# Altium schematic sheet BCM3.SchDoc
size A4; SheetNumber: 3; SheetTotal: 5
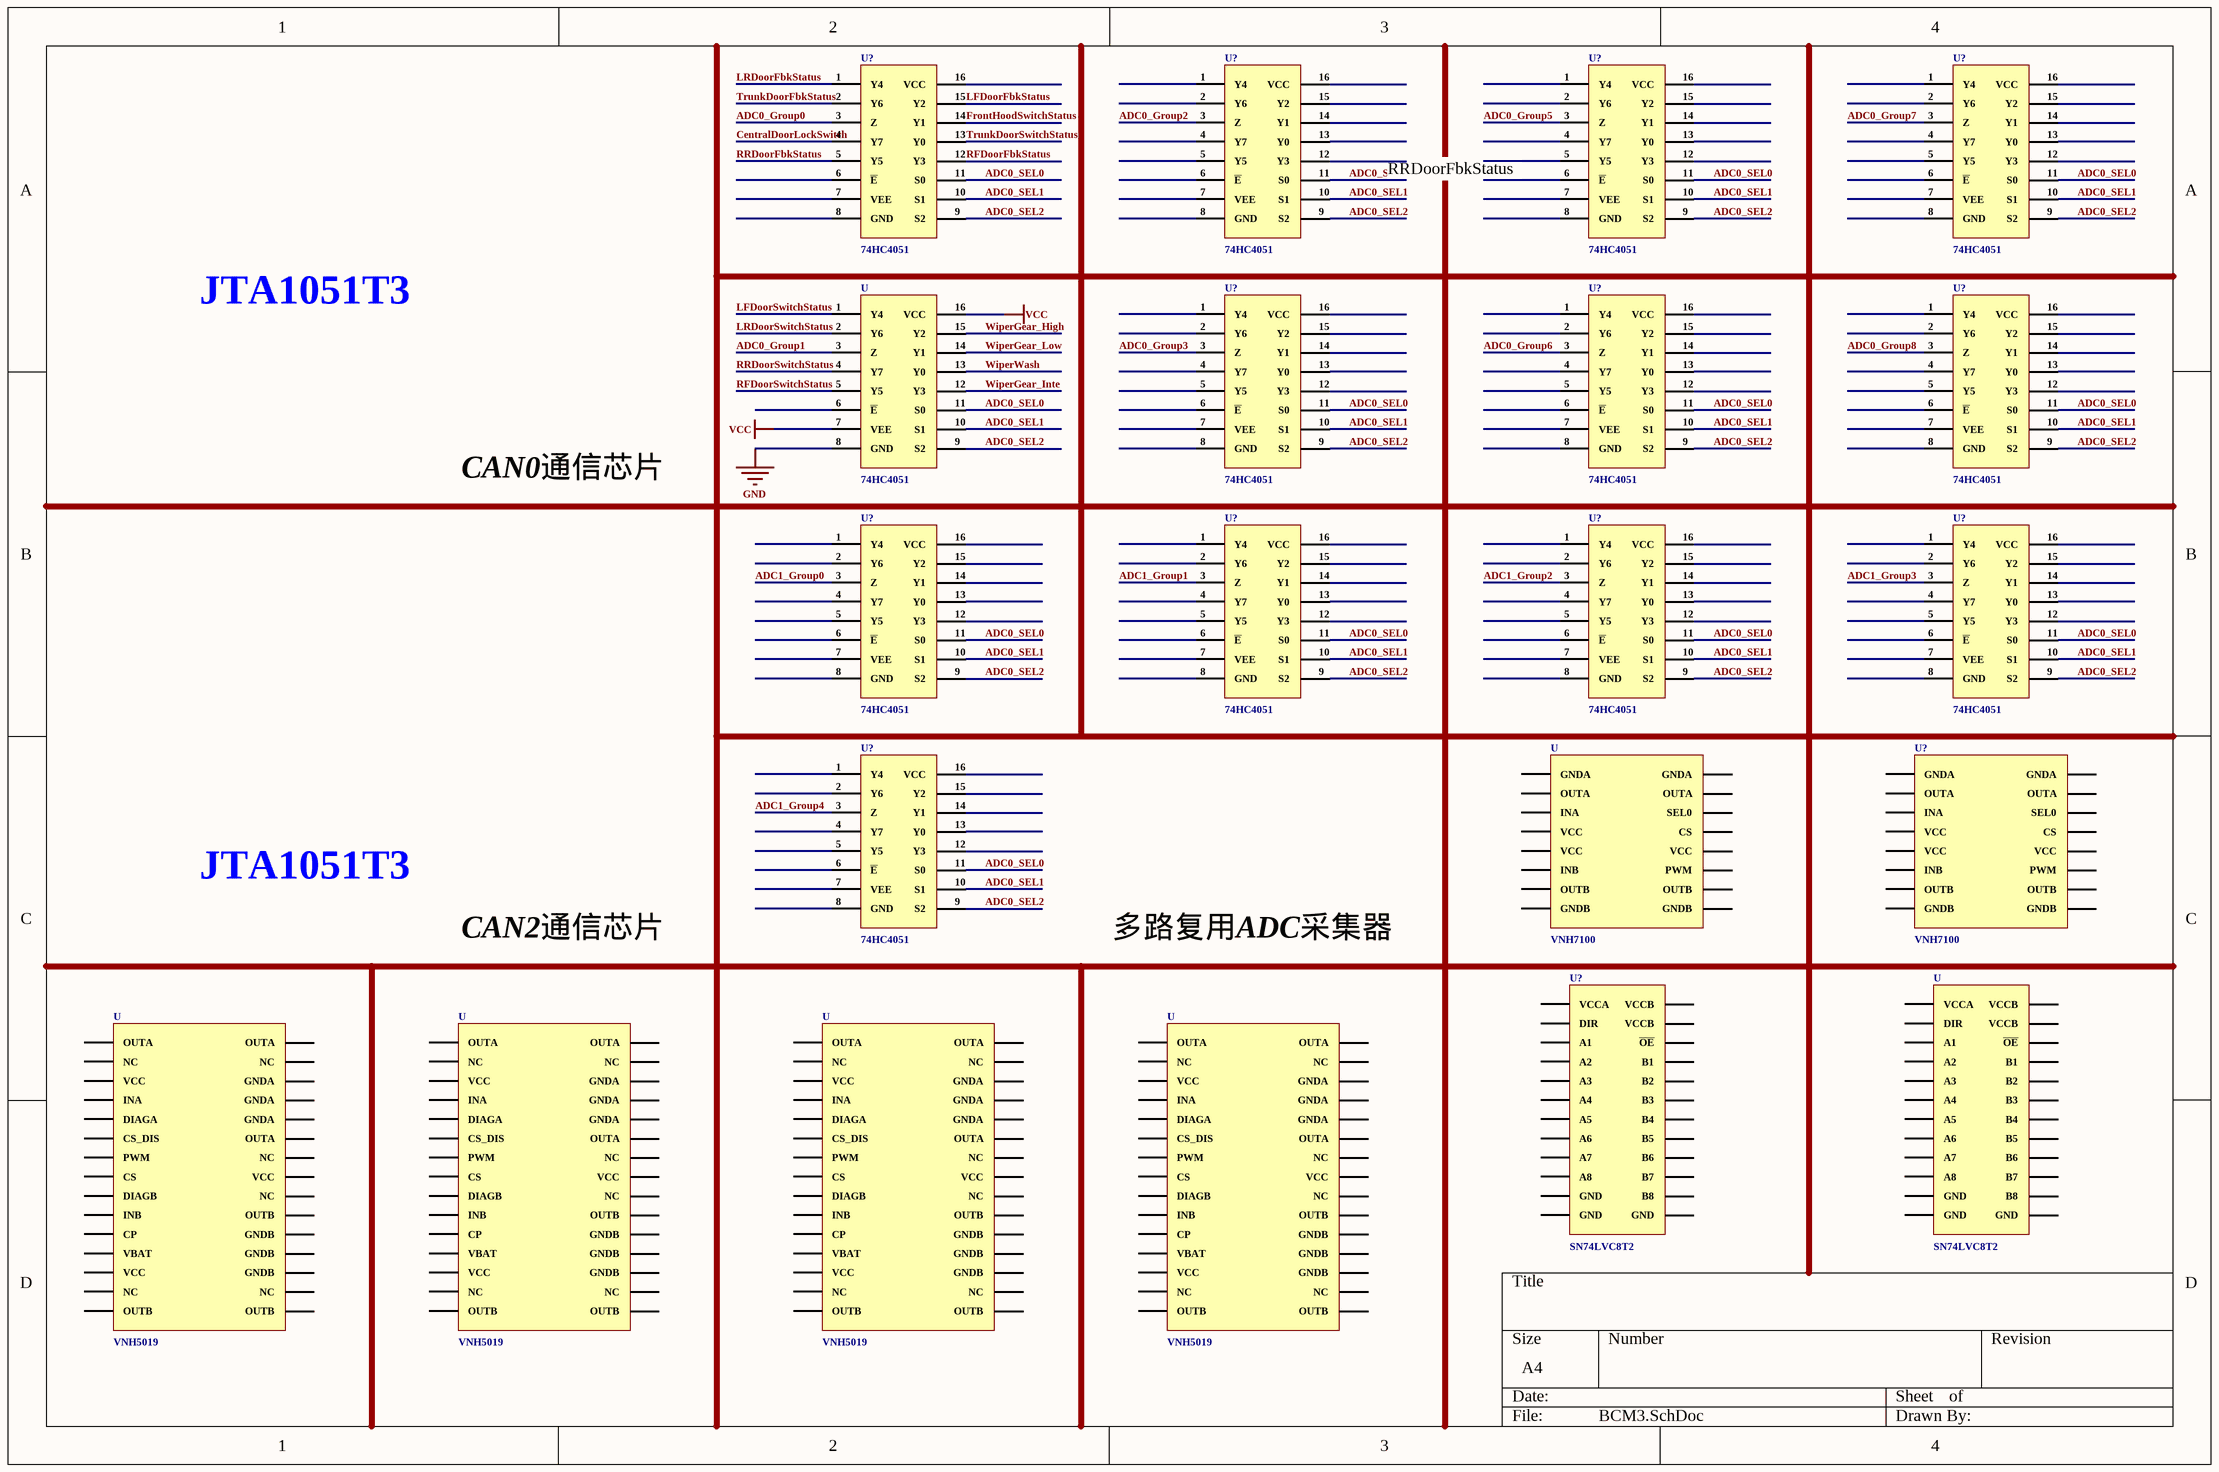
[diagram p0: BCM3.SchDoc]

## Parts
(Parts that share a designator on the sheet are numbered #1, #2 ... from top to bottom, then left to right.)
U#1  74HC4051
U#2  VNH7100
U#3  SN74LVC8T2
U#4  VNH5019
U#5  VNH5019
U#6  VNH5019
U#7  VNH5019
U?#1  74HC4051
U?#2  74HC4051
U?#3  74HC4051
U?#4  74HC4051
U?#5  74HC4051
U?#6  74HC4051
U?#7  74HC4051
U?#8  74HC4051
U?#9  74HC4051
U?#10  74HC4051
U?#11  74HC4051
U?#12  74HC4051
U?#13  VNH7100
U?#14  SN74LVC8T2

## Nets
GND: U#1.8(GND)
VCC: U#1.7(VEE) U#1.16(VCC)
ADC0_Group0: U?#1.3(Z)
ADC0_Group1: U#1.3(Z)
ADC0_Group2: U?#2.3(Z)
ADC0_Group3: U?#5.3(Z)
ADC0_Group5: U?#3.3(Z)
ADC0_Group6: U?#6.3(Z)
ADC0_Group7: U?#4.3(Z)
ADC0_Group8: U?#7.3(Z)
ADC0_SEL0: U#1.11(S0) U?#1.11(S0) U?#2.11(S0) U?#3.11(S0) U?#4.11(S0) U?#5.11(S0) U?#6.11(S0) U?#7.11(S0) U?#8.11(S0) U?#9.11(S0) U?#10.11(S0) U?#11.11(S0) U?#12.11(S0)
ADC0_SEL1: U#1.10(S1) U?#1.10(S1) U?#2.10(S1) U?#3.10(S1) U?#4.10(S1) U?#5.10(S1) U?#6.10(S1) U?#7.10(S1) U?#8.10(S1) U?#9.10(S1) U?#10.10(S1) U?#11.10(S1) U?#12.10(S1)
ADC0_SEL2: U#1.9(S2) U?#1.9(S2) U?#2.9(S2) U?#3.9(S2) U?#4.9(S2) U?#5.9(S2) U?#6.9(S2) U?#7.9(S2) U?#8.9(S2) U?#9.9(S2) U?#10.9(S2) U?#11.9(S2) U?#12.9(S2)
ADC1_Group0: U?#8.3(Z)
ADC1_Group1: U?#9.3(Z)
ADC1_Group2: U?#10.3(Z)
ADC1_Group3: U?#11.3(Z)
ADC1_Group4: U?#12.3(Z)
CentralDoorLockSwitch: U?#1.4(Y7)
FrontHoodSwitchStatus: U?#1.14(Y1)
LFDoorFbkStatus: U?#1.15(Y2)
LFDoorSwitchStatus: U#1.1(Y4)
LRDoorFbkStatus: U?#1.1(Y4)
LRDoorSwitchStatus: U#1.2(Y6)
RFDoorFbkStatus: U?#1.12(Y3)
RFDoorSwitchStatus: U#1.5(Y5)
RRDoorFbkStatus: U?#1.5(Y5)
RRDoorSwitchStatus: U#1.4(Y7)
TrunkDoorFbkStatus: U?#1.2(Y6)
TrunkDoorSwitchStatus: U?#1.13(Y0)
WiperGear_High: U#1.15(Y2)
WiperGear_Inte: U#1.12(Y3)
WiperGear_Low: U#1.14(Y1)
WiperWash: U#1.13(Y0)

Not connected (* = marked no-connect by the designer): U#1 6(~{E}); U#2 30(GNDA) 31(OUTA) 32(INA) 33(VCC) 34(VCC) 35(INB) 36(OUTB) 37(GNDB) 38(CS) 39(VCC) 40(PWM) 41(OUTB) 42(GNDB); U#3 2(DIR) ?1(A1) VCCA; U#4 43(OUTA) 44(NC) 45(VCC) 46(INA) 47(DIAGA) 48(CS_DIS) 49(PWM) 50(CS) 51(DIAGB) 52(INB) 53(CP) 54(VBAT) 55(VCC) 56(NC) 57(OUTB); U#5 43(OUTA) 44(NC) 45(VCC) 46(INA) 47(DIAGA) 48(CS_DIS) 49(PWM) 50(CS) 51(DIAGB) 52(INB) 53(CP) 54(VBAT) 55(VCC) 56(NC) 57(OUTB); U#6 43(OUTA) 44(NC) 45(VCC) 46(INA) 47(DIAGA) 48(CS_DIS) 49(PWM) 50(CS) 51(DIAGB) 52(INB) 53(CP) 54(VBAT) 55(VCC) 56(NC) 57(OUTB); U#7 43(OUTA) 44(NC) 45(VCC) 46(INA) 47(DIAGA) 48(CS_DIS) 49(PWM) 50(CS) 51(DIAGB) 52(INB) 53(CP) 54(VBAT) 55(VCC) 56(NC) 57(OUTB); U?#1 6(~{E}) 7(VEE) 8(GND) 16(VCC); U?#2 1(Y4) 2(Y6) 4(Y7) 5(Y5) 6(~{E}) 7(VEE) 8(GND) 12(Y3) 13(Y0) 14(Y1) 15(Y2) 16(VCC); U?#3 1(Y4) 2(Y6) 4(Y7) 5(Y5) 6(~{E}) 7(VEE) 8(GND) 12(Y3) 13(Y0) 14(Y1) 15(Y2) 16(VCC); U?#4 1(Y4) 2(Y6) 4(Y7) 5(Y5) 6(~{E}) 7(VEE) 8(GND) 12(Y3) 13(Y0) 14(Y1) 15(Y2) 16(VCC); U?#5 1(Y4) 2(Y6) 4(Y7) 5(Y5) 6(~{E}) 7(VEE) 8(GND) 12(Y3) 13(Y0) 14(Y1) 15(Y2) 16(VCC); U?#6 1(Y4) 2(Y6) 4(Y7) 5(Y5) 6(~{E}) 7(VEE) 8(GND) 12(Y3) 13(Y0) 14(Y1) 15(Y2) 16(VCC); U?#7 1(Y4) 2(Y6) 4(Y7) 5(Y5) 6(~{E}) 7(VEE) 8(GND) 12(Y3) 13(Y0) 14(Y1) 15(Y2) 16(VCC); U?#8 1(Y4) 2(Y6) 4(Y7) 5(Y5) 6(~{E}) 7(VEE) 8(GND) 12(Y3) 13(Y0) 14(Y1) 15(Y2) 16(VCC); U?#9 1(Y4) 2(Y6) 4(Y7) 5(Y5) 6(~{E}) 7(VEE) 8(GND) 12(Y3) 13(Y0) 14(Y1) 15(Y2) 16(VCC); U?#10 1(Y4) 2(Y6) 4(Y7) 5(Y5) 6(~{E}) 7(VEE) 8(GND) 12(Y3) 13(Y0) 14(Y1) 15(Y2) 16(VCC); U?#11 1(Y4) 2(Y6) 4(Y7) 5(Y5) 6(~{E}) 7(VEE) 8(GND) 12(Y3) 13(Y0) 14(Y1) 15(Y2) 16(VCC); U?#12 1(Y4) 2(Y6) 4(Y7) 5(Y5) 6(~{E}) 7(VEE) 8(GND) 12(Y3) 13(Y0) 14(Y1) 15(Y2) 16(VCC); U?#13 30(GNDA) 31(OUTA) 32(INA) 33(VCC) 34(VCC) 35(INB) 36(OUTB) 37(GNDB) 38(CS) 39(VCC) 40(PWM) 41(OUTB) 42(GNDB); U?#14 2(DIR) ?1(A1) VCCA

## Notes on the sheet
- (near U?#3) RRDoorFbkStatus
- JTA1051T3
- CAN0通信芯片
- CAN2通信芯片
- 多路复用ADC采集器